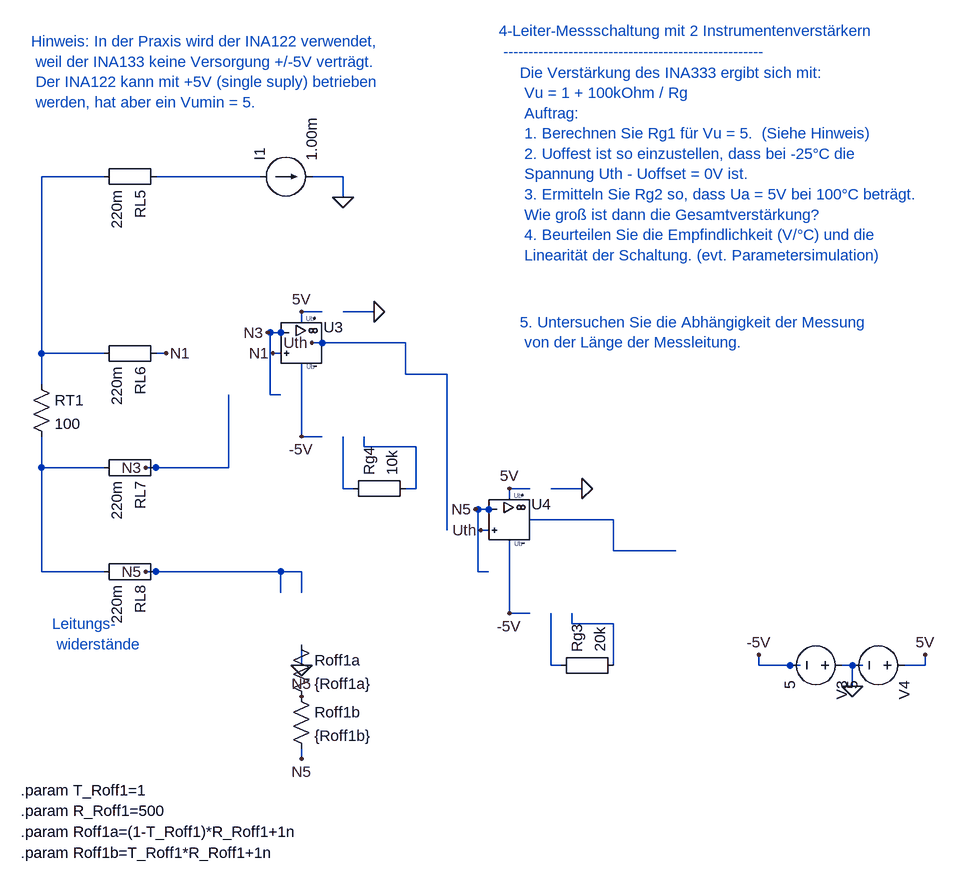
[diagram p0: schematic 1_5_2_PT100_Sensor_in_4-Leiter-Schaltung_mit_2_INA333.asc]
1_5_2_PT100_Sensor_in_4-Leiter-Schaltung_mit_2_INA333.asc, the LTspice schematic file:
Version 4
SHEET 1 880 680
WIRE 512 256 528 256
WIRE 464 496 448 496
WIRE 448 496 448 592
WIRE 448 592 464 592
WIRE 496 480 496 464
WIRE 496 464 528 464
WIRE 496 544 496 656
WIRE 496 656 528 656
WIRE 528 512 656 512
WIRE 656 512 656 560
WIRE 1248 1008 1264 1008
WIRE 1344 1008 1360 1008
WIRE 784 768 768 768
WIRE 768 768 768 864
WIRE 768 864 784 864
WIRE 816 752 816 736
WIRE 816 736 848 736
WIRE 816 816 816 928
WIRE 816 928 848 928
WIRE 848 784 976 784
WIRE 976 784 976 832
WIRE 560 288 560 256
WIRE 560 256 528 256
WIRE 272 256 432 256
WIRE 192 256 96 256
WIRE 96 256 96 528
WIRE 96 656 96 704
WIRE 96 528 96 576
WIRE 192 528 96 528
WIRE 96 704 96 864
WIRE 96 864 192 864
WIRE 192 704 96 704
WIRE 384 592 384 704
WIRE 384 704 272 704
WIRE 608 464 560 464
WIRE 1344 1040 1344 1008
WIRE 1344 1008 1328 1008
WIRE 1456 992 1456 1008
WIRE 1456 1008 1424 1008
WIRE 1264 1008 1200 1008
WIRE 1200 1008 1200 992
WIRE 928 736 880 736
WIRE 720 800 720 560
WIRE 720 560 656 560
WIRE 496 896 496 864
WIRE 464 864 272 864
WIRE 464 896 464 864
WIRE 496 976 496 1008
WIRE 496 864 464 864
WIRE 896 1008 880 1008
WIRE 880 1008 880 928
WIRE 976 1008 976 944
WIRE 976 944 912 944
WIRE 912 944 912 928
WIRE 1072 832 976 832
WIRE 576 736 560 736
WIRE 560 736 560 656
WIRE 656 736 672 736
WIRE 672 736 672 672
WIRE 672 672 592 672
WIRE 592 672 592 656
WIRE 464 528 452 528
WIRE 272 528 288 528
WIRE 464 496 444 496
WIRE 272 704 256 704
WIRE 496 1136 496 1152
WIRE 272 864 256 864
WIRE 784 768 764 768
WIRE 784 800 772 800
WIRE 528 512 512 512
FLAG 560 288 0
FLAG 608 464 0
FLAG 496 1008 0
FLAG 1344 1040 0
FLAG 928 736 0
FLAG 1344 1040 0
FLAG 560 288 0
FLAG 608 464 0
FLAG 496 1008 0
FLAG 928 736 0
FLAG 452 528 N1
FLAG 288 528 N1
FLAG 444 496 N3
FLAG 256 704 N3
FLAG 496 464 5V
FLAG 1456 992 5V
FLAG 816 736 5V
FLAG 1200 992 -5V
FLAG 496 656 -5V
FLAG 816 928 -5V
FLAG 496 1152 N5
FLAG 256 864 N5
FLAG 496 1056 N5
FLAG 764 768 N5
FLAG 772 800 Uth
FLAG 512 512 Uth
SYMBOL current 432 256 R270
SYMATTR InstName I1
SYMATTR Value 1.00m
SYMBOL res 80 560 R0
SYMATTR InstName RT1
SYMATTR Value 100
SYMBOL Misc\EuropeanResistor 288 240 R90
SYMATTR InstName RL5
SYMATTR Value 220m
SYMBOL Misc\EuropeanResistor 288 512 R90
SYMATTR InstName RL6
SYMATTR Value 220m
SYMBOL Misc\EuropeanResistor 288 688 R90
SYMATTR InstName RL7
SYMATTR Value 220m
SYMBOL Misc\EuropeanResistor 288 848 R90
SYMATTR InstName RL8
SYMATTR Value 220m
SYMBOL UniversalOpAmp2 496 512 R0
SYMATTR InstName U3
SYMATTR Value UniversalOpAmp2
SYMBOL Misc\EuropeanResistor 880 1024 R270
SYMATTR InstName Rg3
SYMATTR Value 20k
SYMBOL voltage 1344 1008 R90
SYMATTR InstName V3
SYMATTR Value 5
SYMBOL voltage 1440 1008 R90
SYMATTR InstName V4
SYMATTR Value 5
SYMBOL UniversalOpAmp2 816 784 R0
SYMATTR InstName U4
SYMATTR Value UniversalOpAmp2
SYMBOL res 480 960 R0
SYMATTR InstName Roff1a
SYMATTR Value {Roff1a}
SYMBOL res 480 1040 R0
SYMATTR InstName Roff1b
SYMATTR Value {Roff1b}
SYMBOL Misc\EuropeanResistor 560 752 R270
SYMATTR InstName Rg4
SYMATTR Value 10k
TEXT 64 1200 Left 2 !.param T_Roff1=1
TEXT 64 1232 Left 2 !.param R_Roff1=500
TEXT 64 1264 Left 2 !.param Roff1a=(1-T_Roff1)*R_Roff1+1n
TEXT 64 1296 Left 2 !.param Roff1b=T_Roff1*R_Roff1+1n
TEXT 800 32 Left 2 ;4-Leiter-Messschaltung mit 2 Instrumentenverstärkern \n ----------------------------------------------------
TEXT 112 944 Left 2 ;Leitungs- \n widerstände
TEXT 832 96 Left 2 ;Die Verstärkung des INA333 ergibt sich mit: \n Vu = 1 + 100kOhm / Rg \n Auftrag: \n 1. Berechnen Sie Rg1 für Vu = 5.  (Siehe Hinweis) \n 2. Uoffest ist so einzustellen, dass bei -25°C die \n Spannung Uth - Uoffset = 0V ist. \n 3. Ermitteln Sie Rg2 so, dass Ua = 5V bei 100°C beträgt. \n Wie groß ist dann die Gesamtverstärkung? \n 4. Beurteilen Sie die Empfindlichkeit (V/°C) und die \n Linearität der Schaltung. (evt. Parametersimulation)
TEXT 832 480 Left 2 ;5. Untersuchen Sie die Abhängigkeit der Messung \n von der Länge der Messleitung.
TEXT 80 48 Left 2 ;Hinweis: In der Praxis wird der INA122 verwendet, \n weil der INA133 keine Versorgung +/-5V verträgt. \n Der INA122 kann mit +5V (single suply) betrieben \n werden, hat aber ein Vumin = 5.

The netlist it stands for:
* 1_5_2_PT100_Sensor_in_4-Leiter-Schaltung_mit_2_INA333.asc
I1 N002 0 1.00m
RT1 N003 N004 100
RL5 N002 N003 220m
RL6 N1 N003 220m
RL7 N3 N004 220m
RL8 N5 N004 220m
XU3 N1 N3 5V -5V Uth level2 UniversalOpAmp2 Avol=1Meg GBW=10Meg Slew=10Meg Ilimit=25m Rail=0 Vos=0 En=0 Enk=0 In=0 Ink=0 Rin=500Meg  ; pins In+ In- V+ V- OUT
Rg3 N005 N006 20k
V3 0 -5V 5
V4 5V 0 5
XU4 Uth N5 5V -5V N001 level2 UniversalOpAmp2 Avol=1Meg GBW=10Meg Slew=10Meg Ilimit=25m Rail=0 Vos=0 En=0 Enk=0 In=0 Ink=0 Rin=500Meg  ; pins In+ In- V+ V- OUT
Roff1a 0 N5 {Roff1a}
Roff1b N5 N5 {Roff1b}
Rg4 N007 N008 10k
.param T_Roff1=1
.param R_Roff1=500
.param Roff1a=(1-T_Roff1)*R_Roff1+1n
.param Roff1b=T_Roff1*R_Roff1+1n
* 4-Leiter-Messschaltung mit 2 Instrumentenverstärkern
*  ----------------------------------------------------
* Leitungs-
*  widerstände
* Die Verstärkung des INA333 ergibt sich mit:
*  Vu = 1 + 100kOhm / Rg
*  Auftrag:
*  1. Berechnen Sie Rg1 für Vu = 5.  (Siehe Hinweis)
*  2. Uoffest ist so einzustellen, dass bei -25°C die
*  Spannung Uth - Uoffset = 0V ist.
*  3. Ermitteln Sie Rg2 so, dass Ua = 5V bei 100°C beträgt.
*  Wie groß ist dann die Gesamtverstärkung?
*  4. Beurteilen Sie die Empfindlichkeit (V/°C) und die
*  Linearität der Schaltung. (evt. Parametersimulation)
* 5. Untersuchen Sie die Abhängigkeit der Messung
*  von der Länge der Messleitung.
* Hinweis: In der Praxis wird der INA122 verwendet,
*  weil der INA133 keine Versorgung +/-5V verträgt.
*  Der INA122 kann mit +5V (single suply) betrieben
*  werden, hat aber ein Vumin = 5.
.lib UniversalOpAmp2.lib
.backanno
.end